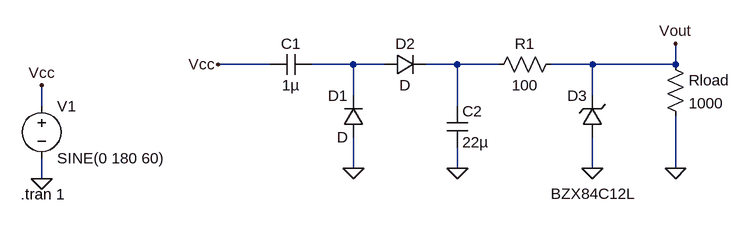
[diagram p0: schematic Draft1.asc]
Draft1.asc, the LTspice schematic file:
Version 4
SHEET 1 880 680
WIRE 64 144 -16 144
WIRE 192 144 128 144
WIRE 240 144 192 144
WIRE 352 144 304 144
WIRE 416 144 352 144
WIRE 560 144 496 144
WIRE 688 144 688 112
WIRE 688 144 560 144
WIRE 192 192 192 144
WIRE 560 192 560 144
WIRE -288 208 -288 176
WIRE 352 208 352 144
WIRE 192 304 192 256
WIRE 352 304 352 272
WIRE 560 304 560 256
WIRE 688 304 688 224
WIRE -288 320 -288 288
FLAG 192 304 0
FLAG 352 304 0
FLAG 688 112 Vout
FLAG -16 144 Vcc
FLAG -288 320 0
FLAG -288 176 Vcc
FLAG 560 304 0
FLAG 688 304 0
SYMBOL cap 128 128 R90
WINDOW 0 0 32 VBottom 2
WINDOW 3 32 32 VTop 2
SYMATTR InstName C1
SYMATTR Value 1µ
SYMBOL diode 208 256 R180
WINDOW 0 24 64 Left 2
WINDOW 3 24 0 Left 2
SYMATTR InstName D1
SYMBOL diode 240 160 R270
WINDOW 0 32 32 VTop 2
WINDOW 3 0 32 VBottom 2
SYMATTR InstName D2
SYMBOL cap 336 208 R0
SYMATTR InstName C2
SYMATTR Value 22µ
SYMBOL voltage -288 192 R0
WINDOW 123 0 0 Left 0
WINDOW 39 0 0 Left 0
SYMATTR InstName V1
SYMATTR Value SINE(0 180 60)
SYMBOL res 512 128 R90
WINDOW 0 0 56 VBottom 2
WINDOW 3 32 56 VTop 2
SYMATTR InstName R1
SYMATTR Value 100
SYMBOL zener 576 256 R180
WINDOW 0 24 64 Left 2
WINDOW 3 -51 -87 Left 2
SYMATTR InstName D3
SYMATTR Value BZX84C12L
SYMBOL res 672 128 R0
SYMATTR InstName Rload
SYMATTR Value 1000
TEXT -320 344 Left 2 !.tran 1

The netlist it stands for:
* Draft1.asc
C1 N001 Vcc 1µ
D1 0 N001 D
D2 N001 N002 D
C2 N002 0 22µ
V1 Vcc 0 SINE(0 180 60)
R1 Vout N002 100
D3 0 Vout BZX84C12L
Rload Vout 0 1000
.model D D
.lib standard.dio
.tran 1
.backanno
.end